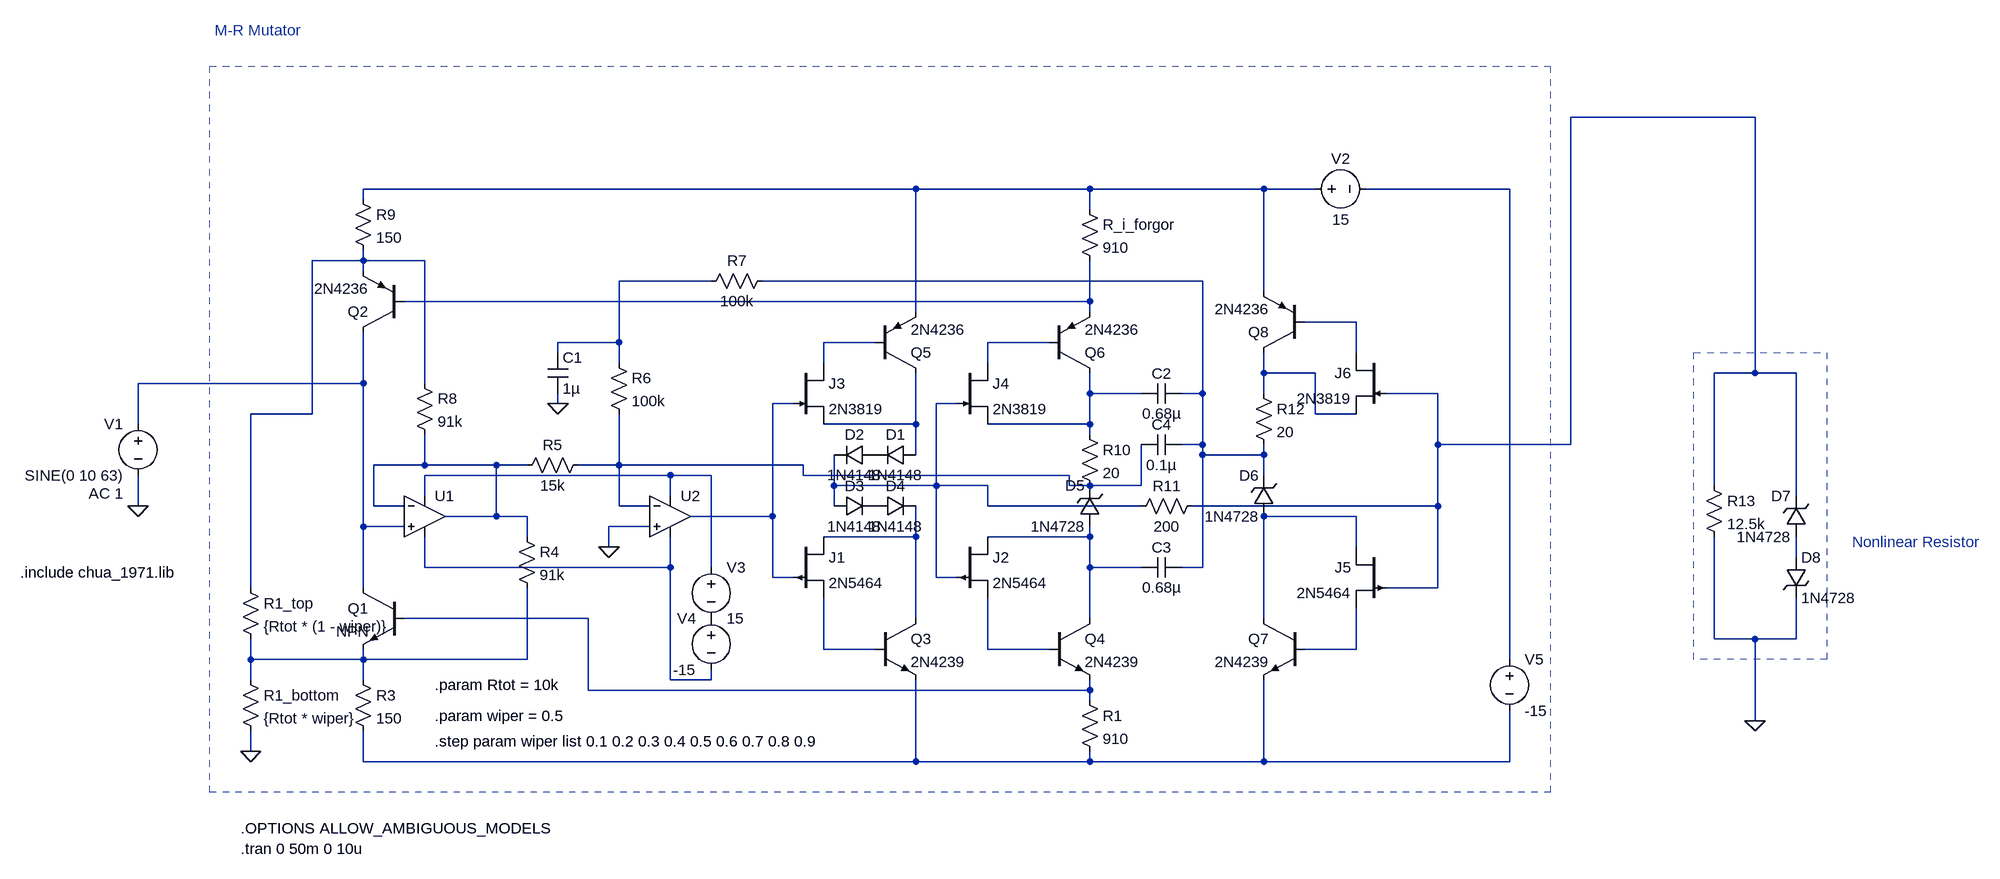
[diagram p0: schematic chua_memristor.asc]
chua_memristor.asc, the LTspice schematic file:
Version 4.1
SHEET 1 2336 1176
WIRE 1968 -320 1680 -320
WIRE 656 -208 -208 -208
WIRE 928 -208 656 -208
WIRE 1200 -208 928 -208
WIRE 1280 -208 1200 -208
WIRE 1584 -208 1360 -208
WIRE -208 -192 -208 -208
WIRE 928 -176 928 -208
WIRE -208 -96 -208 -112
WIRE -208 -96 -288 -96
WIRE -112 -96 -208 -96
WIRE -208 -80 -208 -96
WIRE 336 -64 192 -64
WIRE 1104 -64 416 -64
WIRE 1200 -48 1200 -208
WIRE 928 -32 928 -96
WIRE 928 -32 -144 -32
WIRE 656 -16 656 -208
WIRE 928 -16 928 -32
WIRE 1344 0 1264 0
WIRE 192 32 192 -64
WIRE 192 32 96 32
WIRE 592 32 512 32
WIRE 864 32 768 32
WIRE 96 48 96 32
WIRE 1344 48 1344 0
WIRE 192 64 192 32
WIRE 512 64 512 32
WIRE 768 64 768 32
WIRE 1200 80 1200 48
WIRE 1280 80 1200 80
WIRE 1968 80 1968 -320
WIRE 1968 80 1904 80
WIRE 2032 80 1968 80
WIRE -208 96 -208 16
WIRE -208 96 -560 96
WIRE -112 96 -112 -96
WIRE 928 112 928 80
WIRE 1008 112 928 112
WIRE 1104 112 1104 -64
WIRE 1104 112 1072 112
WIRE 1200 112 1200 80
WIRE 1472 112 1392 112
WIRE 96 128 96 112
WIRE 464 128 432 128
WIRE 720 128 688 128
WIRE -288 144 -288 -96
WIRE -288 144 -384 144
WIRE 1280 144 1280 80
WIRE 1344 144 1280 144
WIRE -560 160 -560 96
WIRE 656 160 656 80
WIRE 656 160 512 160
WIRE 928 160 928 112
WIRE 928 160 768 160
WIRE 928 176 928 160
WIRE 1104 192 1104 112
WIRE 1104 192 1072 192
WIRE 1472 192 1472 112
WIRE 1680 192 1680 -320
WIRE 1680 192 1472 192
WIRE 656 208 656 160
WIRE 1104 208 1104 192
WIRE 1200 208 1200 192
WIRE 1200 208 1104 208
WIRE -112 224 -112 176
WIRE -112 224 -192 224
WIRE 0 224 -112 224
WIRE 48 224 0 224
WIRE 192 224 192 144
WIRE 192 224 128 224
WIRE 480 224 192 224
WIRE 272 240 -112 240
WIRE 336 240 272 240
WIRE 480 240 480 224
WIRE 896 240 480 240
WIRE 1200 240 1200 208
WIRE 528 256 528 208
WIRE 688 256 688 128
WIRE 688 256 528 256
WIRE 768 256 688 256
WIRE 896 256 896 240
WIRE 928 256 896 256
WIRE 1008 256 1008 192
WIRE 1008 256 928 256
WIRE 1904 256 1904 80
WIRE -112 272 -112 240
WIRE 272 272 272 240
WIRE 2032 272 2032 80
WIRE -560 288 -560 240
WIRE -192 288 -192 224
WIRE -144 288 -192 288
WIRE 192 288 192 224
WIRE 240 288 192 288
WIRE 528 288 528 256
WIRE 768 288 768 256
WIRE 1008 288 768 288
WIRE 1472 288 1472 192
WIRE 1472 288 1088 288
WIRE 0 304 0 224
WIRE 0 304 -80 304
WIRE 48 304 0 304
WIRE 432 304 432 128
WIRE 432 304 304 304
WIRE 1344 304 1200 304
WIRE -208 320 -208 96
WIRE -144 320 -208 320
WIRE 240 320 176 320
WIRE 48 336 48 304
WIRE 656 336 656 288
WIRE 656 336 512 336
WIRE 928 336 928 320
WIRE 928 336 768 336
WIRE 176 352 176 320
WIRE 1344 352 1344 304
WIRE 2032 368 2032 336
WIRE -112 384 -112 336
WIRE 272 384 272 336
WIRE 272 384 -112 384
WIRE 336 384 336 240
WIRE 928 384 928 336
WIRE 1008 384 928 384
WIRE 1104 384 1104 208
WIRE 1104 384 1072 384
WIRE 432 400 432 304
WIRE 464 400 432 400
WIRE 688 400 688 256
WIRE 720 400 688 400
WIRE -384 416 -384 144
WIRE -208 416 -208 320
WIRE 1472 416 1472 288
WIRE 1472 416 1392 416
WIRE 144 464 -144 464
WIRE 656 464 656 336
WIRE 928 464 928 384
WIRE 1200 464 1200 304
WIRE 1904 496 1904 336
WIRE 1968 496 1904 496
WIRE 2032 496 2032 432
WIRE 2032 496 1968 496
WIRE 512 512 512 432
WIRE 592 512 512 512
WIRE 768 512 768 432
WIRE 864 512 768 512
WIRE 1344 512 1344 448
WIRE 1344 512 1264 512
WIRE -384 528 -384 496
WIRE -208 528 -208 512
WIRE -208 528 -384 528
WIRE 48 528 48 416
WIRE 48 528 -208 528
WIRE 1584 528 1584 -208
WIRE -384 560 -384 528
WIRE -208 560 -208 528
WIRE 272 560 272 384
WIRE 336 560 336 544
WIRE 336 560 272 560
WIRE 144 576 144 464
WIRE 928 576 928 560
WIRE 928 576 144 576
WIRE 928 592 928 576
WIRE 1968 624 1968 496
WIRE -384 672 -384 640
WIRE -208 688 -208 640
WIRE 656 688 656 560
WIRE 656 688 -208 688
WIRE 928 688 928 672
WIRE 928 688 656 688
WIRE 1200 688 1200 560
WIRE 1200 688 928 688
WIRE 1584 688 1584 608
WIRE 1584 688 1200 688
FLAG -560 288 0
FLAG -384 672 0
FLAG 176 352 0
FLAG 96 128 0
FLAG 1968 624 0
SYMBOL voltage -560 144 M0
WINDOW 123 24 124 Left 2
WINDOW 39 0 0 Left 0
SYMATTR InstName V1
SYMATTR Value SINE(0 10 63)
SYMATTR Value2 AC 1
SYMBOL res -400 400 R0
SYMATTR InstName R1_top
SYMATTR Value {Rtot * (1 - wiper)}
SYMBOL res -400 544 R0
SYMATTR InstName R1_bottom
SYMATTR Value {Rtot * wiper}
SYMBOL npn -144 416 M0
SYMATTR InstName Q1
SYMBOL res -224 544 R0
SYMATTR InstName R3
SYMATTR Value 150
SYMBOL OpAmps\\UniversalOpAmp2 -112 304 R0
SYMATTR InstName U1
SYMBOL res 32 320 R0
SYMATTR InstName R4
SYMATTR Value 91k
SYMBOL res 144 208 R90
WINDOW 0 0 56 VBottom 2
WINDOW 3 32 56 VTop 2
SYMATTR InstName R5
SYMATTR Value 15k
SYMBOL OpAmps\\UniversalOpAmp2 272 304 R0
SYMATTR InstName U2
SYMBOL res 176 48 R0
SYMATTR InstName R6
SYMATTR Value 100k
SYMBOL cap 80 48 R0
SYMATTR InstName C1
SYMATTR Value 1µ
SYMBOL res 432 -80 R90
WINDOW 0 0 56 VBottom 2
WINDOW 3 32 56 VTop 2
SYMATTR InstName R7
SYMATTR Value 100k
SYMBOL pnp -144 16 R180
SYMATTR InstName Q2
SYMATTR Value 2N4236
SYMBOL res -224 -208 R0
SYMATTR InstName R9
SYMATTR Value 150
SYMBOL res -128 80 R0
SYMATTR InstName R8
SYMATTR Value 91k
SYMBOL pjf 464 336 R0
SYMATTR InstName J1
SYMATTR Value 2N5464
SYMBOL npn 592 464 R0
SYMATTR InstName Q3
SYMATTR Value 2N4239
SYMBOL npn 864 464 R0
SYMATTR InstName Q4
SYMATTR Value 2N4239
SYMBOL res 912 576 R0
SYMATTR InstName R1
SYMATTR Value 910
SYMBOL njf 464 64 R0
SYMATTR InstName J3
SYMATTR Value 2N3819
SYMBOL diode 656 192 R90
WINDOW 0 0 32 VBottom 2
WINDOW 3 32 32 VTop 2
SYMATTR InstName D1
SYMATTR Value 1N4148
SYMBOL diode 592 192 R90
WINDOW 0 0 32 VBottom 2
WINDOW 3 32 32 VTop 2
SYMATTR InstName D2
SYMATTR Value 1N4148
SYMBOL diode 528 304 R270
WINDOW 0 32 32 VTop 2
WINDOW 3 0 32 VBottom 2
SYMATTR InstName D3
SYMATTR Value 1N4148
SYMBOL diode 592 304 R270
WINDOW 0 32 32 VTop 2
WINDOW 3 0 32 VBottom 2
SYMATTR InstName D4
SYMATTR Value 1N4148
SYMBOL njf 720 64 R0
SYMATTR InstName J4
SYMATTR Value 2N3819
SYMBOL pjf 720 336 R0
SYMATTR InstName J2
SYMATTR Value 2N5464
SYMBOL res 912 -192 R0
SYMATTR InstName R_i_forgor
SYMATTR Value 910
SYMBOL cap 1072 96 R90
WINDOW 0 0 32 VBottom 2
WINDOW 3 32 32 VTop 2
SYMATTR InstName C2
SYMATTR Value 0.68µ
SYMBOL res 912 160 R0
SYMATTR InstName R10
SYMATTR Value 20
SYMBOL zener 944 320 R180
WINDOW 0 24 64 Left 2
WINDOW 3 24 0 Left 2
SYMATTR InstName D5
SYMATTR Value 1N4728
SYMBOL cap 1072 368 R90
WINDOW 0 0 32 VBottom 2
WINDOW 3 32 32 VTop 2
SYMATTR InstName C3
SYMATTR Value 0.68µ
SYMBOL cap 1072 176 R90
WINDOW 0 0 32 VBottom 2
WINDOW 3 32 32 VTop 2
SYMATTR InstName C4
SYMATTR Value 0.1µ
SYMBOL res 1104 272 R90
WINDOW 0 0 56 VBottom 2
WINDOW 3 32 56 VTop 2
SYMATTR InstName R11
SYMATTR Value 200
SYMBOL npn 1264 464 M0
SYMATTR InstName Q7
SYMATTR Value 2N4239
SYMBOL pjf 1392 352 M0
SYMATTR InstName J5
SYMATTR Value 2N5464
SYMBOL pnp 592 80 M180
SYMATTR InstName Q5
SYMATTR Value 2N4236
SYMBOL pnp 864 80 M180
SYMATTR InstName Q6
SYMATTR Value 2N4236
SYMBOL zener 1216 304 R180
WINDOW 0 24 64 Left 2
WINDOW 3 24 0 Left 2
SYMATTR InstName D6
SYMATTR Value 1N4728
SYMBOL njf 1392 48 M0
SYMATTR InstName J6
SYMATTR Value 2N3819
SYMBOL pnp 1264 48 R180
SYMATTR InstName Q8
SYMATTR Value 2N4236
SYMBOL res 1184 96 R0
SYMATTR InstName R12
SYMATTR Value 20
SYMBOL voltage 336 368 R0
WINDOW 123 0 0 Left 0
WINDOW 39 0 0 Left 0
SYMATTR InstName V3
SYMATTR Value 15
SYMBOL res 1888 240 R0
SYMATTR InstName R13
SYMATTR Value 12.5k
SYMBOL zener 2048 336 R180
WINDOW 0 24 64 Left 2
WINDOW 3 24 0 Left 2
SYMATTR InstName D7
SYMATTR Value 1N4728
SYMBOL zener 2016 368 R0
SYMATTR InstName D8
SYMATTR Value 1N4728
SYMBOL voltage 336 448 M0
WINDOW 123 0 0 Left 0
WINDOW 39 0 0 Left 0
SYMATTR InstName V4
SYMATTR Value -15
SYMBOL voltage 1264 -208 R270
WINDOW 0 32 56 VTop 2
WINDOW 3 -32 56 VBottom 2
WINDOW 123 0 0 Left 0
WINDOW 39 0 0 Left 0
SYMATTR InstName V2
SYMATTR Value 15
SYMBOL voltage 1584 512 R0
WINDOW 123 0 0 Left 0
WINDOW 39 0 0 Left 0
SYMATTR InstName V5
SYMATTR Value -15
TEXT -96 568 Left 2 !.param Rtot = 10k
TEXT -96 616 Left 2 !.param wiper = 0.5
TEXT -400 824 Left 2 !.tran 0 50m 0 10u
TEXT -744 392 Left 2 !.include chua_1971.lib
TEXT -400 792 Left 2 !.OPTIONS ALLOW_AMBIGUOUS_MODELS
TEXT -96 656 Left 2 !.step param wiper list 0.1 0.2 0.3 0.4 0.5 0.6 0.7 0.8 0.9
TEXT -440 -456 Left 2 ;M-R Mutator
TEXT 2120 344 Left 2 ;Nonlinear Resistor
RECTANGLE Normal 1648 736 -448 -400 2
RECTANGLE Normal 2080 528 1872 48 2

The netlist it stands for:
* chua_memristor.asc
V1 N012 0 SINE(0 10 63) AC 1
R1_top N004 N029 {Rtot * (1 - wiper)}
R1_bottom N029 0 {Rtot * wiper}
Q1 N012 N025 N029 0 NPN
R3 N029 N030 150
X§U1 N012 N017 N019 N024 N017 level2 Avol=1Meg GBW=10Meg Slew=10Meg Ilimit=25m Rail=0 Vos=0 En=0 Enk=0 In=0 Ink=0 Rin=500Meg  ; pins In+ In- V+ V- OUT
R4 N017 N029 91k
R5 N018 N017 15k
X§U2 0 N018 N019 N024 N014 level2 Avol=1Meg GBW=10Meg Slew=10Meg Ilimit=25m Rail=0 Vos=0 En=0 Enk=0 In=0 Ink=0 Rin=500Meg  ; pins In+ In- V+ V- OUT
R6 N005 N018 100k
C1 N005 0 1µ
R7 N006 N005 100k
Q2 N012 N007 N004 0 2N4236
R9 N002 N004 150
R8 N004 N017 91k
J1 N021 N014 N026 2N5464
Q3 N021 N026 N030 0 2N4239
Q4 N022 N027 N025 0 2N4239
R1 N025 N030 910
J3 N009 N014 N016 2N3819
D1 N016 P001 1N4148
D2 P001 N015 1N4148
D3 N015 P002 1N4148
D4 P002 N021 1N4148
J4 N010 N015 N013 2N3819
J2 N022 N015 N027 2N5464
R_i_forgor N002 N007 910
C2 N006 N013 0.68µ
R10 N013 N018 20
D5 N022 N018 1N4728
C3 N006 N022 0.68µ
C4 N006 N018 0.1µ
R11 N001 N015 200
Q7 N020 N028 N030 0 2N4239
J5 N020 N001 N028 2N5464
Q5 N016 N009 N002 0 2N4236
Q6 N013 N010 N007 0 2N4236
D6 N020 N006 1N4728
J6 N008 N001 N011 2N3819
Q8 N011 N008 N002 0 2N4236
R12 N011 N006 20
V3 N019 P003 15
R13 N001 0 12.5k
D7 N023 N001 1N4728
D8 N023 0 1N4728
V4 P003 N024 -15
V2 N002 N003 15
V5 N003 N030 -15
.model D D
.lib standard.dio
.model NPN NPN
.model PNP PNP
.lib standard.bjt
.model NJF NJF
.model PJF PJF
.lib standard.jft
.param Rtot = 10k
.param wiper = 0.5
.tran 0 50m 0 10u
.include chua_1971.lib
.OPTIONS ALLOW_AMBIGUOUS_MODELS
.step param wiper list 0.1 0.2 0.3 0.4 0.5 0.6 0.7 0.8 0.9
* M-R Mutator
* Nonlinear Resistor
.lib UniversalOpAmp2.lib
.backanno
.end